# Altium schematic sheet Overview.SchDoc
size 594 x 420 mm; SheetNumber: 1; SheetTotal: 1
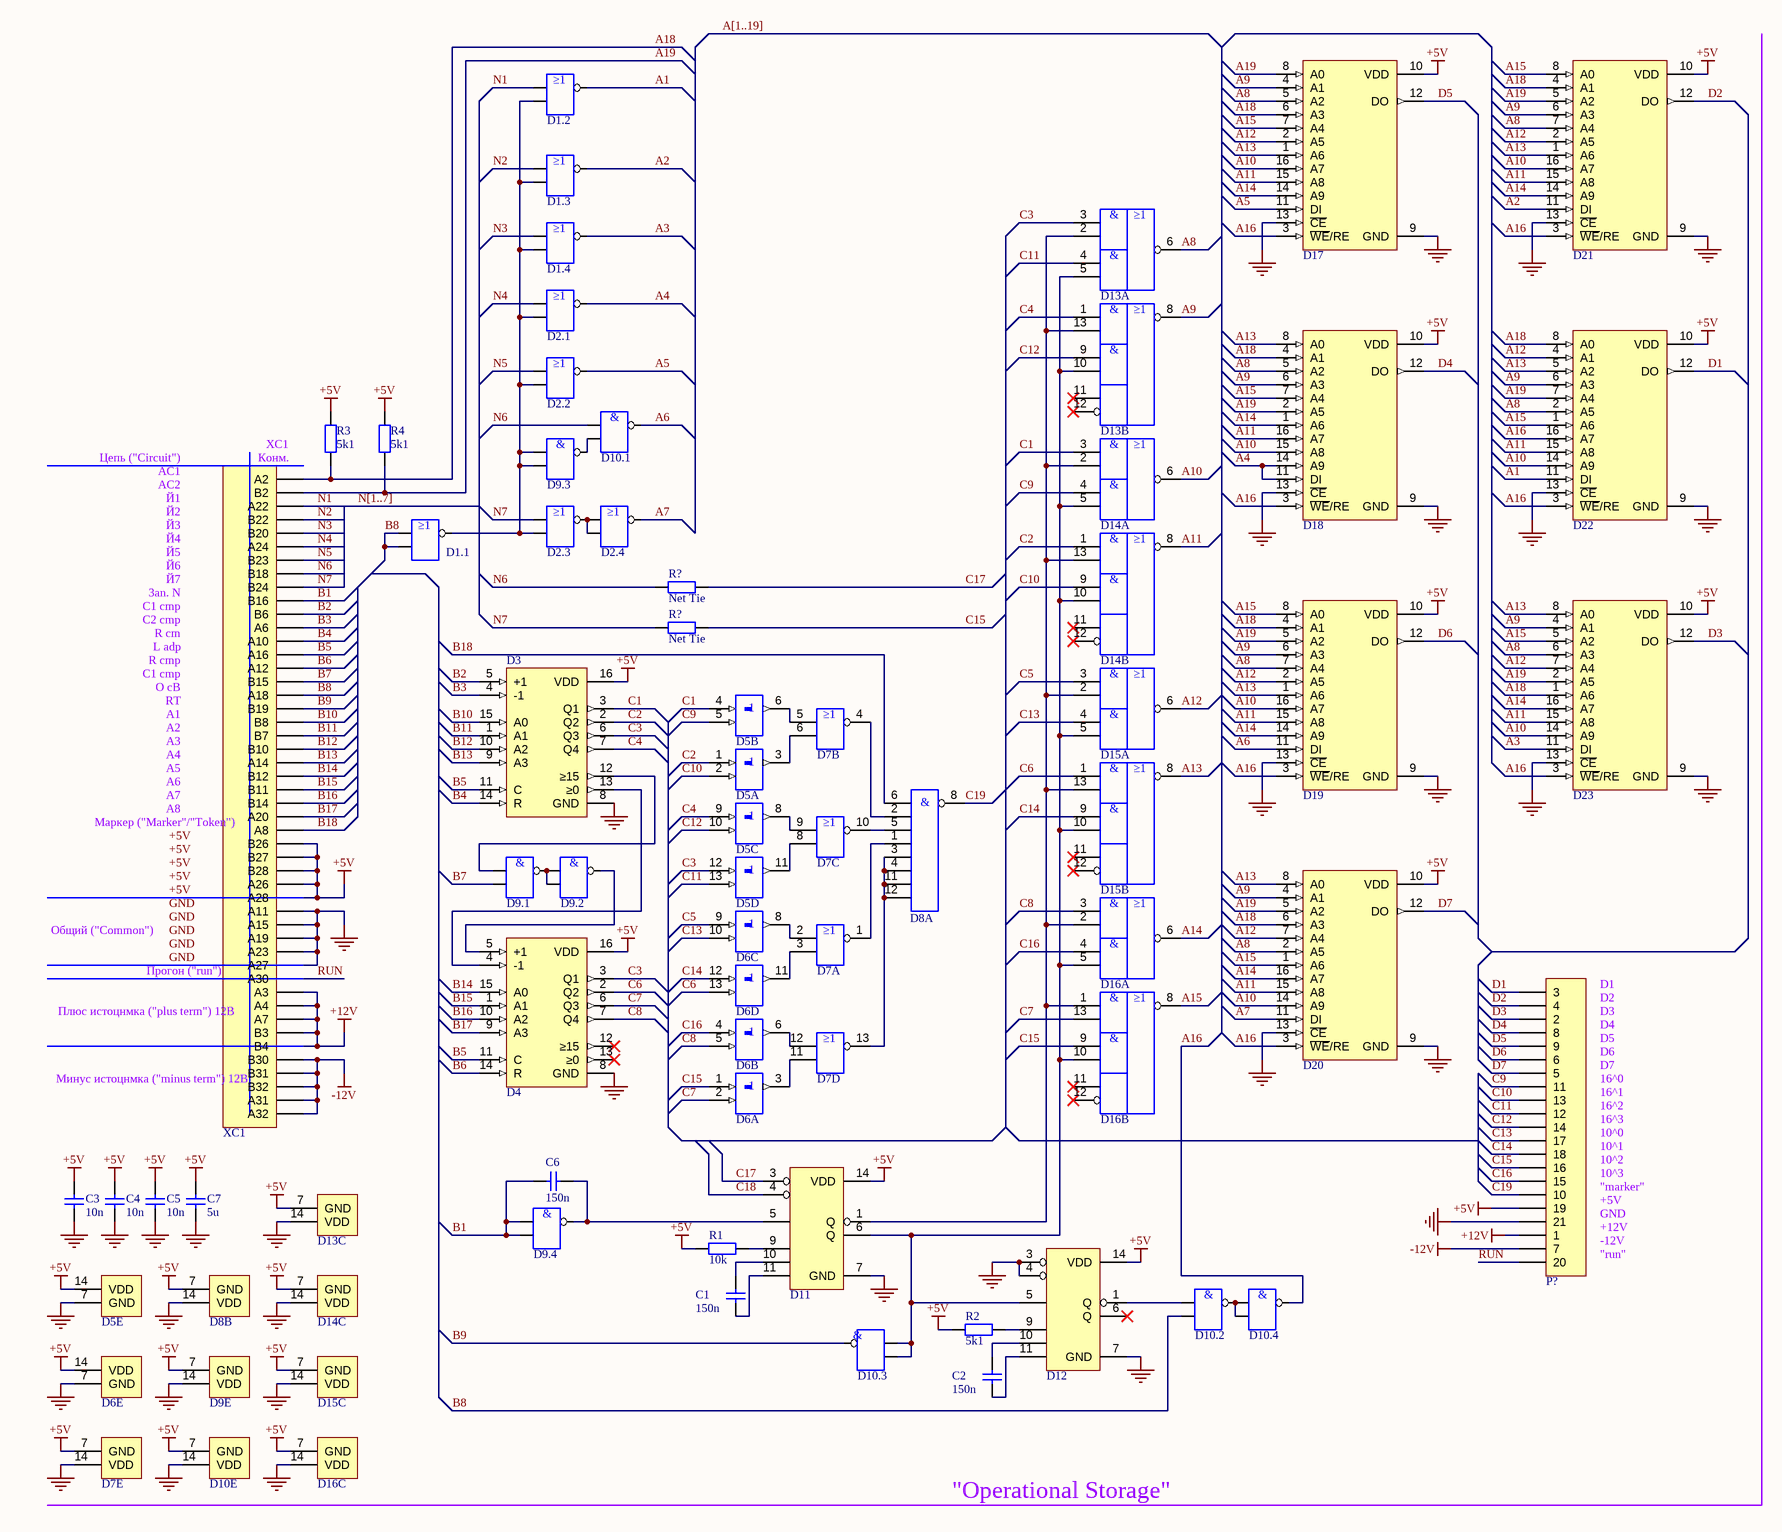
[diagram p0: Overview.SchDoc]

## Parts
(Parts that share a designator on the sheet are numbered #1, #2 ... from top to bottom, then left to right.)
C1  150n
C2  150n
C3  10n
C4  10n
C5  10n
C6  150n
C7  5u
D1.1  -  (value not drawn)
D1.2  -  (value not drawn)
D1.3  -  (value not drawn)
D1.4  -  (value not drawn)
D2.1  -  (value not drawn)
D2.2  -  (value not drawn)
D2.3  -  (value not drawn)
D2.4  -  (value not drawn)
D3  -  (value not drawn)
D4  -  (value not drawn)
D5  -  (value not drawn)  (parts A,B,C,D,E of 5)
D6  -  (value not drawn)  (parts A,B,C,D,E of 5)
D7  -  (value not drawn)  (parts A,B,C,D,E of 5)
D8  -  (value not drawn)  (parts A,B of 2)
D9  -  (value not drawn)  (part E of 5)
D9.1  -  (value not drawn)
D9.2  -  (value not drawn)
D9.3  -  (value not drawn)
D9.4  -  (value not drawn)
D10  -  (value not drawn)  (part E of 5)
D10.1  -  (value not drawn)
D10.2  -  (value not drawn)
D10.3  -  (value not drawn)
D10.4  -  (value not drawn)
D11  -  (value not drawn)
D12  -  (value not drawn)
D13  -  (value not drawn)  (parts A,B,C of 3)
D14  -  (value not drawn)  (parts A,B,C of 3)
D15  -  (value not drawn)  (parts A,B,C of 3)
D16  -  (value not drawn)  (parts A,B,C of 3)
D17  -  (value not drawn)
D18  -  (value not drawn)
D19  -  (value not drawn)
D20  -  (value not drawn)
D21  -  (value not drawn)
D22  -  (value not drawn)
D23  -  (value not drawn)
P?  -  (value not drawn)
R1  10k
R2  5k1
R3  5k1
R4  5k1
R?#1  Net Tie
R?#2  Net Tie
XC1  -  (value not drawn)

## Nets
+5V: C3.2 C4.2 C5.2 C7.2 D3.16(VDD) D4.16(VDD) D5.14(VDD) D6.14(VDD) D7.7(GND) D8.7(GND) D9.7(GND) D10.7(GND) D11.14(VDD) D12.14(VDD) D13.7(GND) D14.7(GND) D15.7(GND) D16.7(GND) D17.10(VDD) D18.10(VDD) D19.10(VDD) D20.10(VDD) D21.10(VDD) D22.10(VDD) D23.10(VDD) P?.19 R1.1 R2.1 R3.2 R4.2 XC1.A26 XC1.A28 XC1.B26 XC1.B27 XC1.B28
+12V: P?.1 XC1.A3 XC1.A4 XC1.A7 XC1.B3 XC1.B4
-12V: P?.7 XC1.A31 XC1.A32 XC1.B30 XC1.B31 XC1.B32
GND: C3.1 C4.1 C5.1 C7.1 D3.8(GND) D4.8(GND) D5.7(GND) D6.7(GND) D7.14(VDD) D8.14(VDD) D9.14(VDD) D10.14(VDD) D11.7(GND) D12.3(A1) D12.4(A2) D12.7(GND) D13.14(VDD) D14.14(VDD) D15.14(VDD) D16.14(VDD) D17.9(GND) D17.13(~{CE}) D18.9(GND) D18.13(~{CE}) D19.9(GND) D19.13(~{CE}) D20.9(GND) D20.13(~{CE}) D21.9(GND) D21.13(~{CE}) D22.9(GND) D22.13(~{CE}) D23.9(GND) D23.13(~{CE}) P?.21 XC1.A11 XC1.A15 XC1.A19 XC1.A23 XC1.A27
A1: D1.2.3 D22.11(DI)
A2: D1.3.3 D21.11(DI)
A3: D1.4.3 D23.11(DI)
A4: D2.1.3 D18.11(DI) D18.14(A9)
A5: D2.2.3 D17.11(DI)
A6: D10.1.3 D19.11(DI)
A7: D2.4.3 D20.11(DI)
A8: D13.6(Y1) D17.5(A2) D18.5(A2) D19.7(A4) D20.2(A5) D21.7(A4) D22.2(A5) D23.6(A3)
A9: D13.8(Y2) D17.4(A1) D18.6(A3) D19.6(A3) D20.4(A1) D21.6(A3) D22.6(A3) D23.4(A1)
A10: D14.6(Y1) D17.16(A7) D18.15(A8) D19.16(A7) D20.14(A9) D21.16(A7) D22.14(A9) D23.14(A9)
A11: D14.8(Y2) D17.15(A8) D18.16(A7) D19.15(A8) D20.15(A8) D21.15(A8) D22.15(A8) D23.15(A8)
A12: D15.6(Y1) D17.2(A5) D19.2(A5) D20.7(A4) D21.2(A5) D22.4(A1) D23.7(A4)
A13: D15.8(Y2) D17.1(A6) D18.8(A0) D19.1(A6) D20.8(A0) D21.1(A6) D22.5(A2) D23.8(A0)
A14: D16.6(Y1) D17.14(A9) D18.1(A6) D19.14(A9) D20.16(A7) D21.14(A9) D23.16(A7)
A15: D16.8(Y2) D17.7(A4) D18.7(A4) D19.8(A0) D20.1(A6) D21.8(A0) D22.1(A6) D23.5(A2)
A16: D10.4.3 D17.3(~{WE}/RE) D18.3(~{WE}/RE) D19.3(~{WE}/RE) D20.3(~{WE}/RE) D21.3(~{WE}/RE) D22.3(~{WE}/RE) D22.16(A7) D23.3(~{WE}/RE)
A18: D17.6(A3) D18.4(A1) D19.4(A1) D20.6(A3) D21.4(A1) D22.8(A0) D23.1(A6) R3.1 XC1.A2
A19: D17.8(A0) D18.2(A5) D19.5(A2) D20.5(A2) D21.5(A2) D22.7(A4) D23.2(A5) R4.1 XC1.B2
B1: C6.1 D9.4.1 D9.4.2 XC1.B16
B2: D3.5(+1) XC1.B6
B3: D3.4(-1) XC1.A6
B4: D3.14(R) XC1.A10
B5: D3.11(C) D4.11(C) XC1.A16
B6: D4.14(R) XC1.A12
B7: D9.1.2 XC1.B15
B8: D1.1.1 D1.1.2 D10.2.2 XC1.A18
B9: D10.3.3 XC1.B19
B10: D3.15(A0) XC1.B8
B11: D3.1(A1) XC1.B7
B12: D3.10(A2) XC1.B10
B13: D3.9(A3) XC1.A14
B14: D4.15(A0) XC1.B12
B15: D4.1(A1) XC1.B11
B16: D4.10(A2) XC1.B14
B17: D4.9(A3) XC1.A20
B18: D8.6(X6) XC1.A8
C1: D3.3(Q1) D5.4(A2) D14.3(X2)
C2: D3.2(Q2) D5.1(A1) D14.1(X5)
C3: D3.6(Q3) D4.3(Q1) D5.12(A4) D13.3(X2)
C4: D3.7(Q4) D5.9(A3) D13.1(X5)
C5: D6.9(A3) D15.3(X2)
C6: D4.2(Q2) D6.13(B4) D15.1(X5)
C7: D4.6(Q3) D6.2(B1) D16.13(X6)
C8: D4.7(Q4) D6.5(B2) D16.3(X2)
C9: D5.5(B2) D14.4(X3) P?.11
C10: D5.2(B1) D14.9(X7) P?.13
C11: D5.13(B4) D13.4(X3) P?.12
C12: D5.10(B3) D13.9(X7) P?.14
C13: D6.10(B3) D15.4(X3) P?.17
C14: D6.12(A4) D15.9(X7) P?.18
C15: D6.1(A1) D16.9(X7) P?.16 R?#2.1
C16: D6.4(A2) D16.4(X3) P?.15
C17: D11.3(A1) R?#1.1
C18: D11.4(A2)
C19: D8.8(Y) P?.10
D1: D22.12(DO) P?.3
D2: D21.12(DO) P?.4
D3: D23.12(DO) P?.2
D4: D18.12(DO) P?.8
D5: D17.12(DO) P?.9
D6: D19.12(DO) P?.6
D7: D20.12(DO) P?.5
N1: D1.2.1 XC1.A22
N2: D1.3.1 XC1.B22
N3: D1.4.1 XC1.B20
N4: D2.1.1 XC1.A24
N5: D2.2.1 XC1.B23
N6: D10.1.1 R?#1.2 XC1.B18
N7: D2.3.1 R?#2.2 XC1.B24
RUN: P?.20 XC1.A30
NetC1_1: C1.1 D11.11(RTCT)
NetC1_2: C1.2 D11.10(CT)
NetC2_1: C2.1 D12.11(RTCT)
NetC2_2: C2.2 D12.10(CT)
NetC6_2: C6.2 D9.4.3 D11.5(B)
NetD1.1_3: D1.1.3 D1.2.2 D1.3.2 D1.4.2 D2.1.2 D2.2.2 D2.3.2 D9.3.1 D9.3.2
NetD2.3_3: D2.3.3 D2.4.1 D2.4.2
NetD3_12: D3.12(≥15) D9.1.1
NetD3_13: D3.13(≥0) D4.4(-1)
NetD4_5: D4.5(+1) D9.2.3
NetD5_3: D5.3(Y1) D7.6(B2)
NetD5_6: D5.6(Y2) D7.5(A2)
NetD5_8: D5.8(Y3) D7.9(A3)
NetD5_11: D5.11(Y4) D7.8(B3)
NetD6_3: D6.3(Y1) D7.11(B4)
NetD6_6: D6.6(Y2) D7.12(A4)
NetD6_8: D6.8(Y3) D7.2(A1)
NetD6_11: D6.11(Y4) D7.3(B1)
NetD7_1: D7.1(Y1) D8.1(X1)
NetD7_4: D7.4(Y2) D8.2(X2)
NetD7_10: D7.10(Y3) D8.5(X5)
NetD7_13: D7.13(Y4) D8.3(X3) D8.4(X4) D8.11(X7) D8.12(X8)
NetD9.1_3: D9.1.3 D9.2.1 D9.2.2
NetD9.3_3: D9.3.3 D10.1.2
NetD10.2_1: D10.2.1 D12.1(Q)
NetD10.2_3: D10.2.3 D10.4.1 D10.4.2
NetD10.3_1: D10.3.1 D10.3.2 D11.6(Q) D12.5(B) D13.5(X4) D13.10(X8) D14.5(X4) D14.10(X8) D15.5(X4) D15.10(X8) D16.5(X4) D16.10(X8)
NetD11_1: D11.1(Q) D13.2(X1) D13.13(X6) D14.2(X1) D14.13(X6) D15.2(X1) D15.13(X6) D16.1(X5) D16.2(X1)
NetD11_9: D11.9(BBH) R1.2
NetD12_9: D12.9(BBH) R2.2

Not connected (* = marked no-connect by the designer): D4 12(≥15)* 13(≥0)*; D12 6(Q)*; D13 11(X9)* 12(X10)*; D14 11(X9)* 12(X10)*; D15 11(X9)* 12(X10)*; D16 11(X9)* 12(X10)*

## Buses and harness runs
bus A[1..19]
bus N[1..7]

## Notes on the sheet
- AC1
- AC2
- Цепь ("Circuit")
- XC1
- (near XC1) Конм.
- Й1
- Й2
- Й3
- Й4
- Й5
- 3an. N
- C1 cmp
- C2 cmp
- Й6
- Й7
- R cm
- L adp
- R cmp
- O cB
- RT
- A1
- A2
- A3
- A4
- A5
- A6
- A7
- A8
- (near XC1) Маркер ("Marker"/"Token")
- Общий ("Common")
- Прогон ("run")
- (near XC1) Плюс истоцнмка ("plus term") 12B
- D1
- D2
- D3
- D4
- (near XC1) Минус истоцнмка ("minus term") 12B
- D5
- D6
- D7
- 16^0
- 16^1
- 16^2
- 16^3
- 10^0
- 10^1
- 10^2
- 10^3
- +5V
- GND
- +12V
- "marker"
- "run"
- -12V
- "Operational Storage"
- Labels drawn without touching a wire or pin: +5V, GND
- DWG NO:
- REV:
- REVISION
- DESCRIPTION
- DATE
- APPROVED
- ENG:
- APPROVALS
- PROJECT
- DSN:
- CHK:
- REFERENCE DOCUMENTS
- PROJECT REVISION:
- TITLE
- DOCUMENT REVISION:
- DESIGN ITEM:
- BOM:
- FAB DWG:
- PCB DWG:
- ASSY DWG:
- SCALE:
- SIZE
- CAGE CODE
- FILE NAME
- DWG NO.
- SHEET
- OF
- REV
- (in symbol NAND) &
- (in symbol NOR) ≥1
- (in symbol К155ЛА2, part A) &
- (in symbol К155ЛЕ1, part A) ≥1
- (in symbol К155ЛЕ1, part B) ≥1
- (in symbol К155ЛЕ1, part C) ≥1
- (in symbol К155ЛЕ1, part D) ≥1
- (in symbol К155ЛР1, part A) &; ≥1
- (in symbol К155ЛР1, part B) &; ≥1

## Library data of the parts
C1-C7 = C
D1.1-D1.4 D2.1-D2.4 = NOR
D3 D4 = K155IE7_counter_4bit_up/down: https://kiloom.ru/spravochnik-radiodetalej/microsxema/k155ie7-km155ie7.html
D5 D6 = К155ЛП5: https://kiloom.ru/spravochnik-radiodetalej/microsxema/k155lp5-km155lp5-kb155lp5-4.html
D7 = К155ЛЕ1: 4x 2 NOR - https://kiloom.ru/spravochnik-radiodetalej/microsxema/k155le1-km155le1.html
D8 = К155ЛА2: 8 input NOR - https://kiloom.ru/spravochnik-radiodetalej/microsxema/k155la2-km155la2-kb155la2-4.html
D9 D10 = К155ЛА3: 4x NAND - https://kiloom.ru/spravochnik-radiodetalej/microsxema/k155la3-km155la3-kb155la3-4.html
D9.1-D9.4 D10.1-D10.4 = NAND
D11 D12 = К155АГ1: Multi-vibrator - https://kiloom.ru/spravochnik-radiodetalej/microsxema/k155ag1.html https://www.microshemca.ru/AG1/
D13-D16 = К155ЛР1: 2x 2x AND to 1x NOR - https://kiloom.ru/spravochnik-radiodetalej/microsxema/k155lr1-km155lr1-kb155lr1-4.html
D17-D23 = КР565РУ2: https://www.radiomuseum.org/tubes/tube_kr565ru2.html
P? = 21x1_Connector
R1-R4 R?#1 R?#2 = R
XC1 = 32x2_Connector